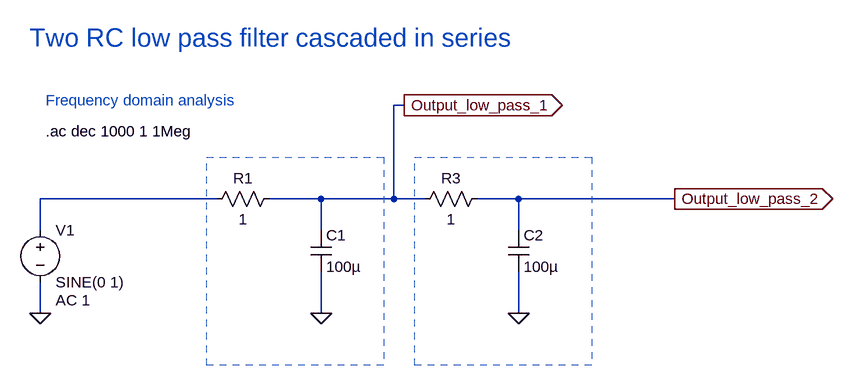
[diagram p0: schematic RC-lowpass-cascaded.asc]
RC-lowpass-cascaded.asc, the LTspice schematic file:
Version 4.1
SHEET 1 1272 680
WIRE 448 -96 432 -96
WIRE 160 48 -112 48
WIRE 320 48 240 48
WIRE 432 48 432 -96
WIRE 432 48 320 48
WIRE 480 48 432 48
WIRE 624 48 560 48
WIRE 864 48 624 48
WIRE -112 96 -112 48
WIRE 320 96 320 48
WIRE 624 96 624 48
WIRE -112 224 -112 176
WIRE 320 224 320 160
WIRE 624 224 624 160
FLAG 320 224 0
FLAG -112 224 0
FLAG 624 224 0
FLAG 448 -96 Output_low_pass_1
IOPIN 448 -96 Out
FLAG 864 48 Output_low_pass_2
IOPIN 864 48 Out
SYMBOL res 144 64 R270
WINDOW 0 32 56 VTop 2
WINDOW 3 0 56 VBottom 2
SYMATTR InstName R1
SYMATTR Value 1
SYMBOL cap 304 96 R0
SYMATTR InstName C1
SYMATTR Value 100µ
SYMBOL voltage -112 80 R0
WINDOW 123 24 124 Left 2
WINDOW 39 0 0 Left 2
SYMATTR Value2 AC 1
SYMATTR InstName V1
SYMATTR Value SINE(0 1)
SYMBOL res 464 64 R270
WINDOW 0 32 56 VTop 2
WINDOW 3 0 56 VBottom 2
SYMATTR InstName R3
SYMATTR Value 1
SYMBOL cap 608 96 R0
SYMATTR InstName C2
SYMATTR Value 100µ
TEXT -128 -200 Left 4 ;Two RC low pass filter cascaded in series
TEXT -104 -56 Left 2 !.ac dec 1000 1 1Meg
TEXT -104 -104 Left 2 ;Frequency domain analysis
RECTANGLE Normal 416 304 144 -16 2
RECTANGLE Normal 736 304 464 -16 2

The netlist it stands for:
* RC-lowpass-cascaded.asc
R1 N001 Output_low_pass_1 1
C1 Output_low_pass_1 0 100µ
V1 N001 0 SINE(0 1) AC 1
R3 Output_low_pass_1 Output_low_pass_2 1
C2 Output_low_pass_2 0 100µ
* Two RC low pass filter cascaded in series
.ac dec 1000 1 1Meg
* Frequency domain analysis
.backanno
.end